# EAGLE design TurretController (EAGLE 9.6.2)

## Sheet 1 of 5: Microcontroller
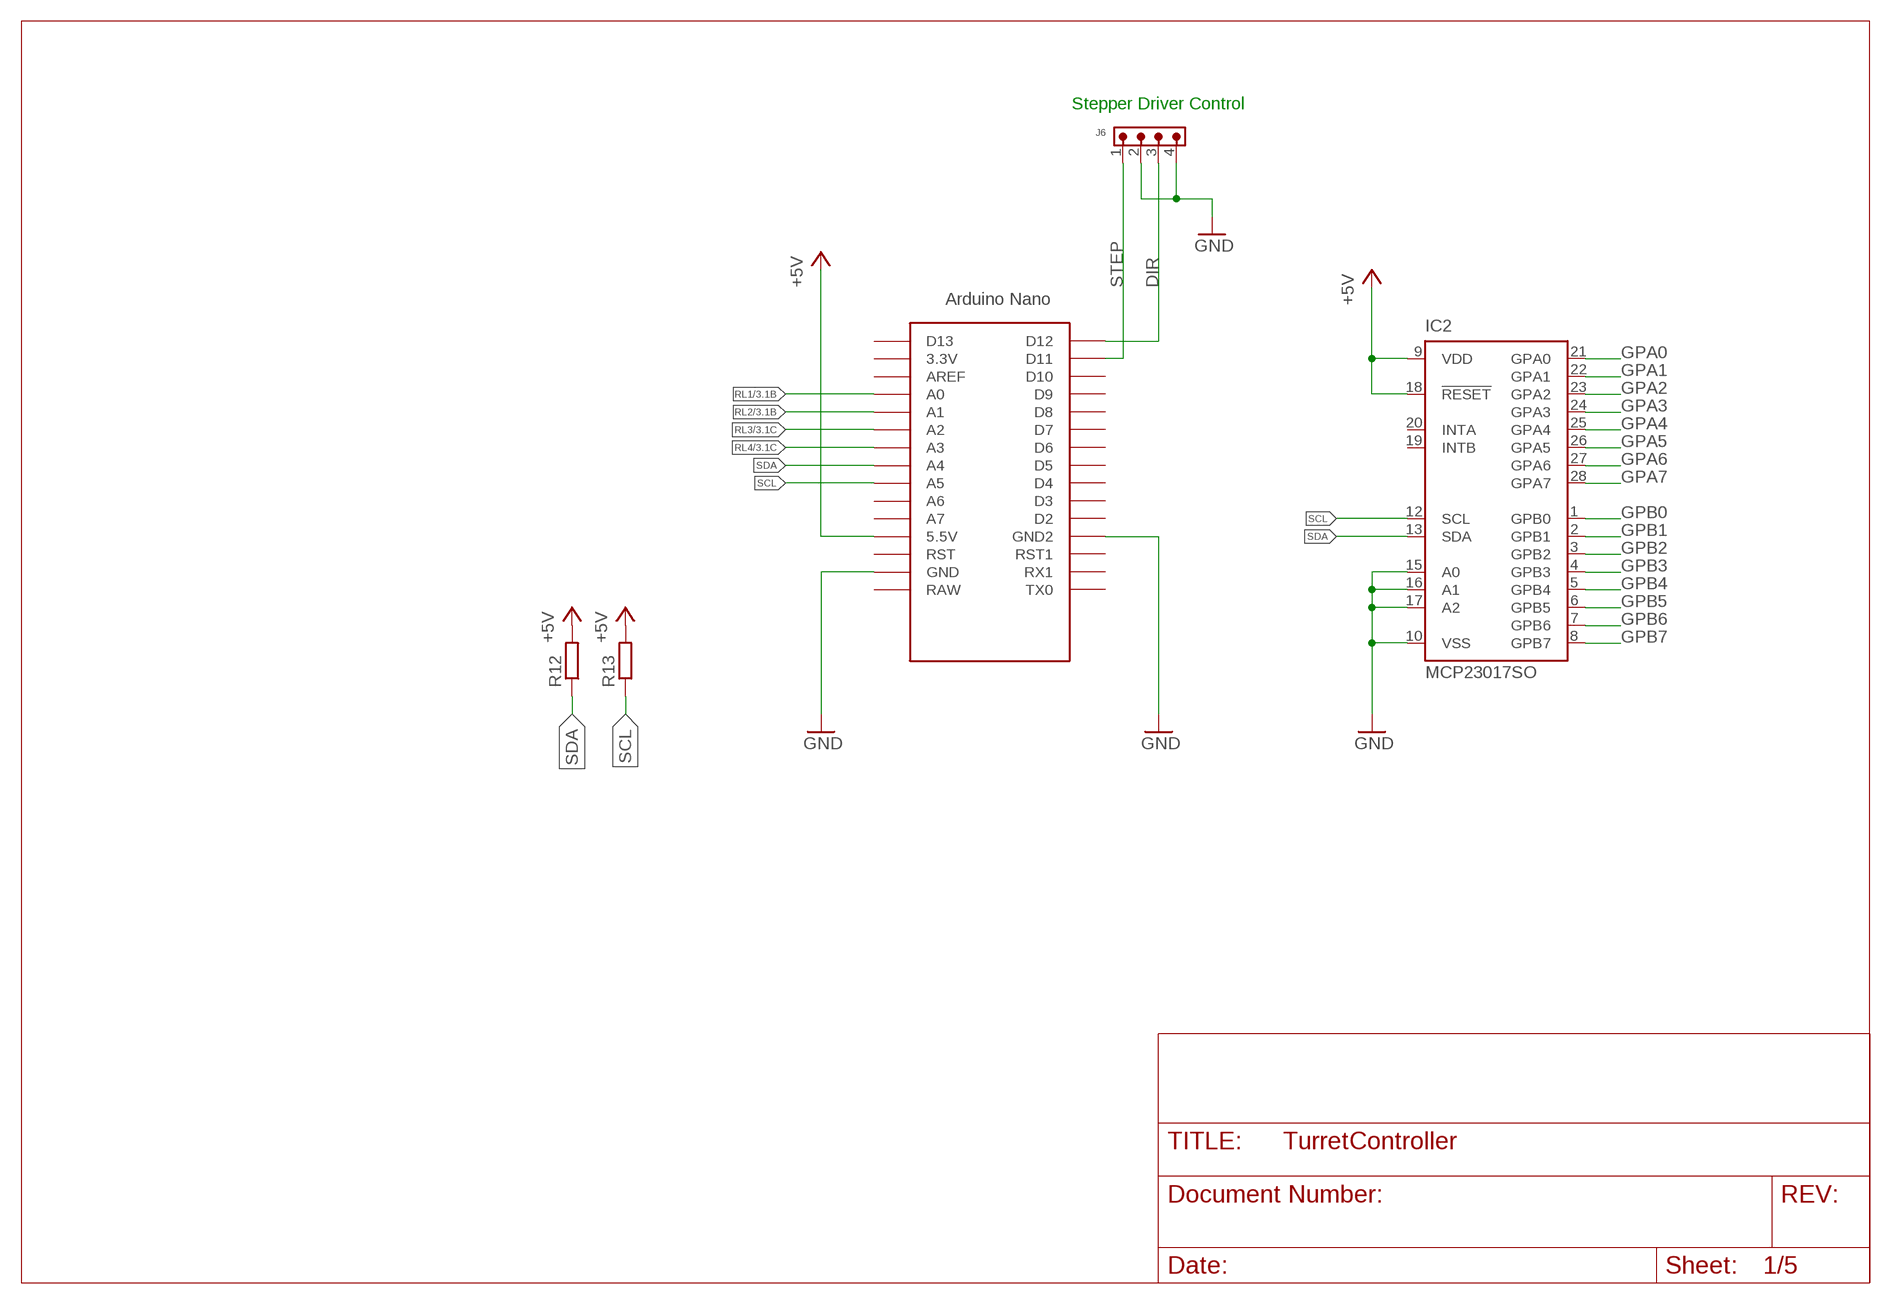
[diagram p0: schematic, sheet 1]

### Parts
IC2  MCP23017SO  [SO28W]
J6  691305330004  [691305330004]
R12  R-EU_R0805  [R0805]
R13  R-EU_R0805  [R0805]
U$1  NANO  [NANO]

### Nets
+5V: IC2.9(VDD) IC2.18(!RESET) R12.2 R13.2 U$1.5V(5.5V) ; also sheet 2,4,5
DIR: J6.3 U$1.D12
GND: IC2.10(VSS) IC2.15(A0) IC2.16(A1) IC2.17(A2) J6.2 J6.4 U$1.GND U$1.GND1(GND2) ; also sheet 2,3,4,5
GPA0: IC2.21(GPA0) ; also sheet 4
GPA1: IC2.22(GPA1) ; also sheet 4
GPA2: IC2.23(GPA2) ; also sheet 4
GPA3: IC2.24(GPA3) ; also sheet 4
GPA4: IC2.25(GPA4) ; also sheet 4
GPA5: IC2.26(GPA5) ; also sheet 4
GPA6: IC2.27(GPA6) ; also sheet 4
GPA7: IC2.28(GPA7) ; also sheet 4
GPB0: IC2.1(GPB0) ; also sheet 5
GPB1: IC2.2(GPB1) ; also sheet 5
GPB2: IC2.3(GPB2) ; also sheet 5
GPB3: IC2.4(GPB3) ; also sheet 5
GPB4: IC2.5(GPB4) ; also sheet 5
GPB5: IC2.6(GPB5) ; also sheet 5
GPB6: IC2.7(GPB6) ; also sheet 5
GPB7: IC2.8(GPB7) ; also sheet 5
RL1: U$1.A0 ; also sheet 3
RL2: U$1.A1 ; also sheet 3
RL3: U$1.A2 ; also sheet 3
RL4: U$1.A3 ; also sheet 3
SCL: IC2.12(SCL) R13.1 U$1.A5
SDA: IC2.13(SDA) R12.1 U$1.A4
STEP: J6.1 U$1.D11
Unconnected: IC2.19(INTB) IC2.20(INTA) U$1.3.3V U$1.A6 U$1.A7 U$1.AREF U$1.D2 U$1.D3 U$1.D4 U$1.D5 U$1.D6 U$1.D7 U$1.D8 U$1.D9 U$1.D10 U$1.D13 U$1.RAW U$1.RST U$1.RST1 U$1.RX1 U$1.TX0

### Notes on the sheet
- Stepper Driver Control

## Sheet 2 of 5: Power Supply
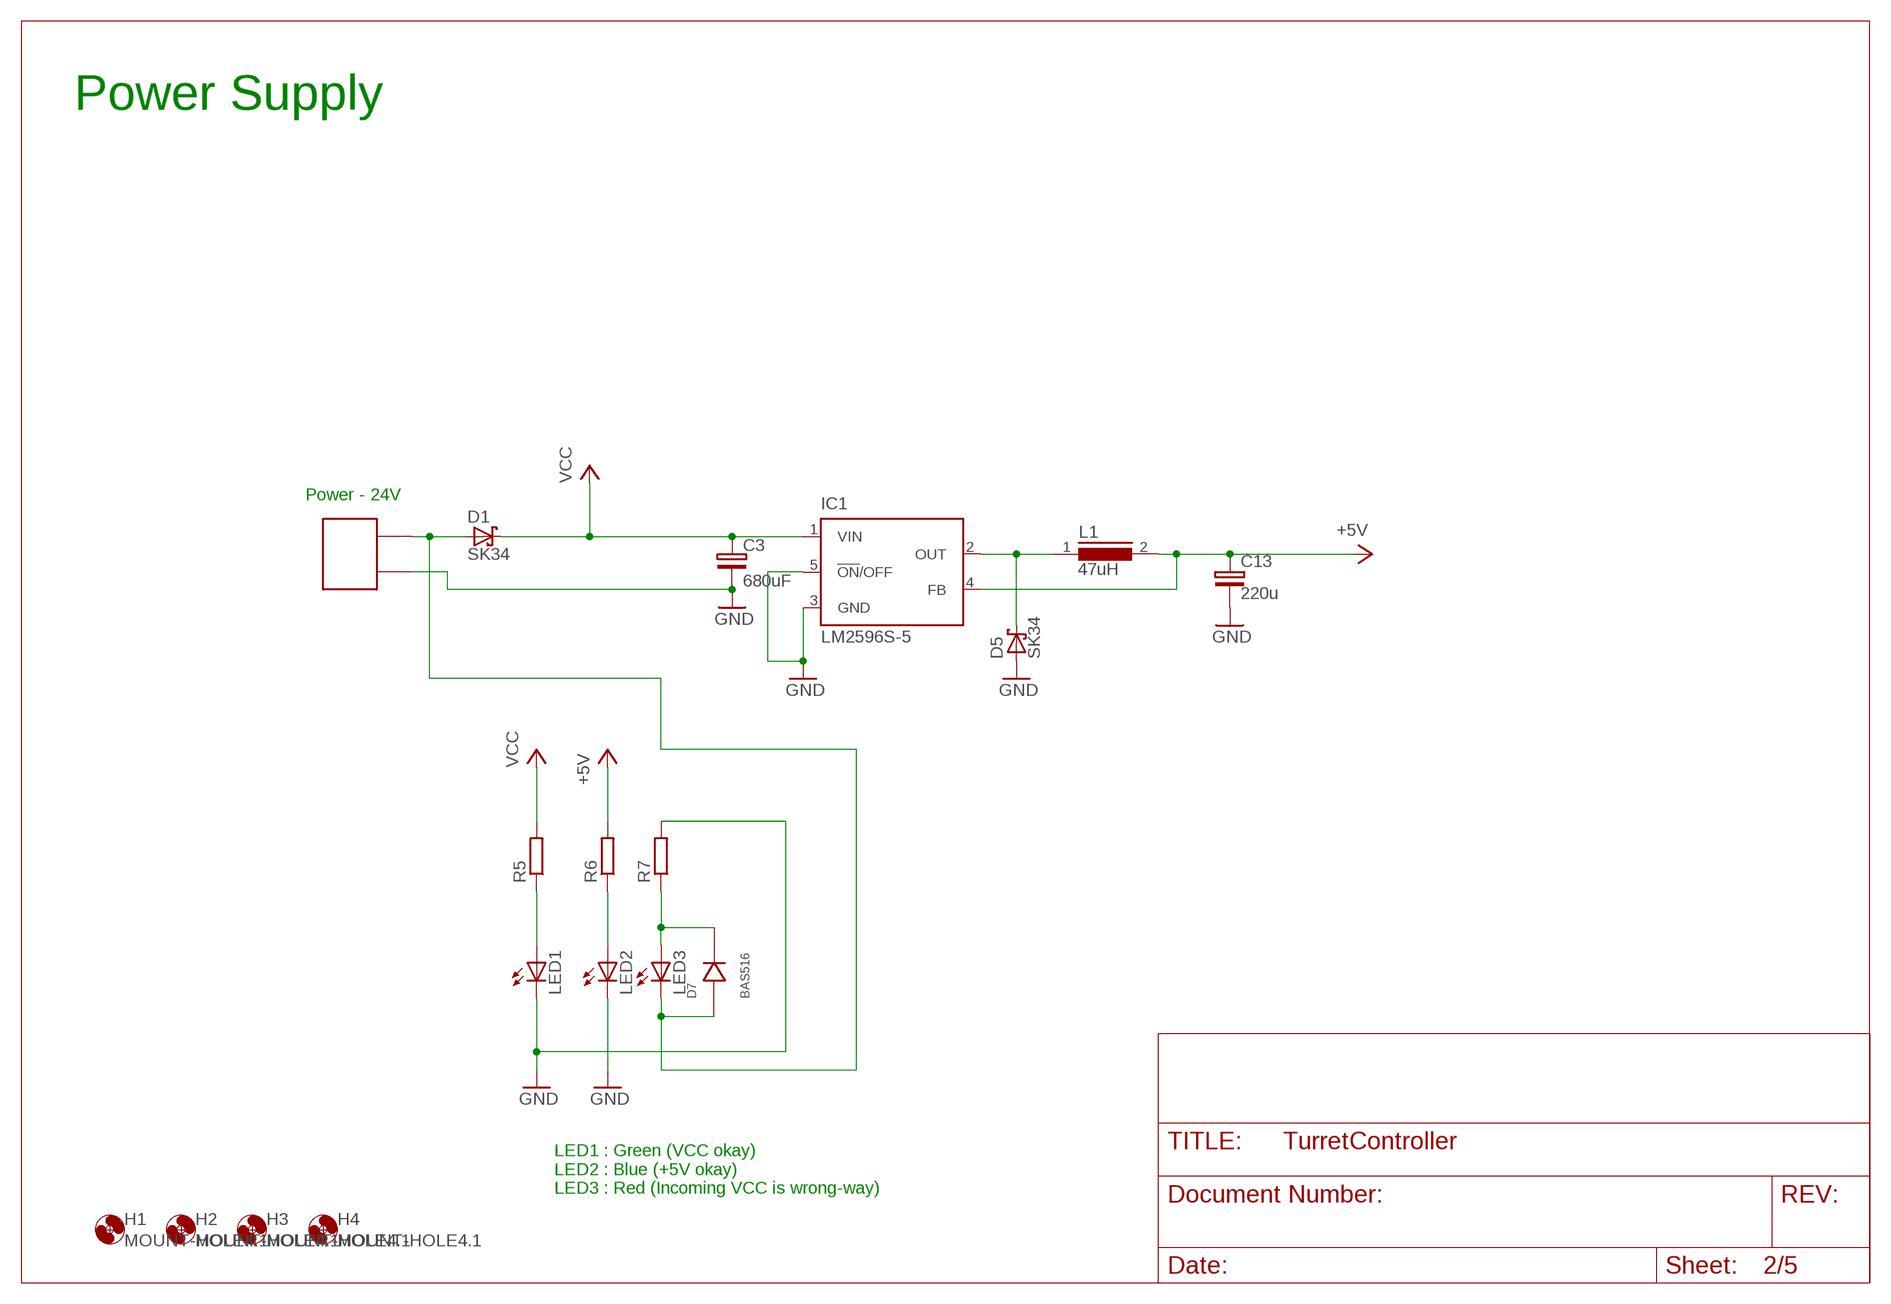
[diagram p1: schematic, sheet 2]

### Parts
C3  680uF  C-EU-ELECT680UF/25V  [C8.15X4X16.5]
C13  220u  PANASONIC-PTH220UF-25V  [PAN-PTH-8X11X3.5]
CN1  2EDG-2  [2EDG-2]
D1  SK34  [DO214AC]
D5  SK34  [DO214AC]
D7  BAS516  [SOD523]
H1  MOUNT-HOLE4.1  [4,1]
H2  MOUNT-HOLE4.1  [4,1]
H3  MOUNT-HOLE4.1  [4,1]
H4  MOUNT-HOLE4.1  [4,1]
IC1  LM2596S-5  LM2596S  [TO263-5]
L1  47uH  INDUCTOR-SMD  [B82476A1]
LED1  LEDCHIPLED_0805  [CHIPLED_0805]
LED2  LEDCHIPLED_0805  [CHIPLED_0805]
LED3  LEDCHIPLED_0805  [CHIPLED_0805]
R5  R-EU_R0805  [R0805]
R6  R-EU_R0805  [R0805]
R7  R-EU_R0805  [R0805]

### Nets
+5V: C13.+ IC1.4(FB) L1.2 R6.2 ; also sheet 1,4,5
GND: C3.- C13.- CN1.P$1 D5.A IC1.3(GND) IC1.5(!ON!/OFF) LED1.C LED2.C R7.2 ; also sheet 1,3,4,5
N$16: D7.C(K) LED3.A R7.1
N$19 [HighPwr]: D5.C IC1.2(OUT) L1.1
N$24: CN1.P$2 D1.A D7.A LED3.C
N$25: LED1.A R5.1
N$26: LED2.A R6.1
VCC: C3.+ D1.C IC1.1(VIN) R5.2 ; also sheet 3,4,5

### Notes on the sheet
- Power Supply
- Power - 24V
- LED1 : Green (VCC okay)
  LED2 : Blue (+5V okay)
  LED3 : Red (Incoming VCC is wrong-way)

## Sheet 3 of 5: Relay Board
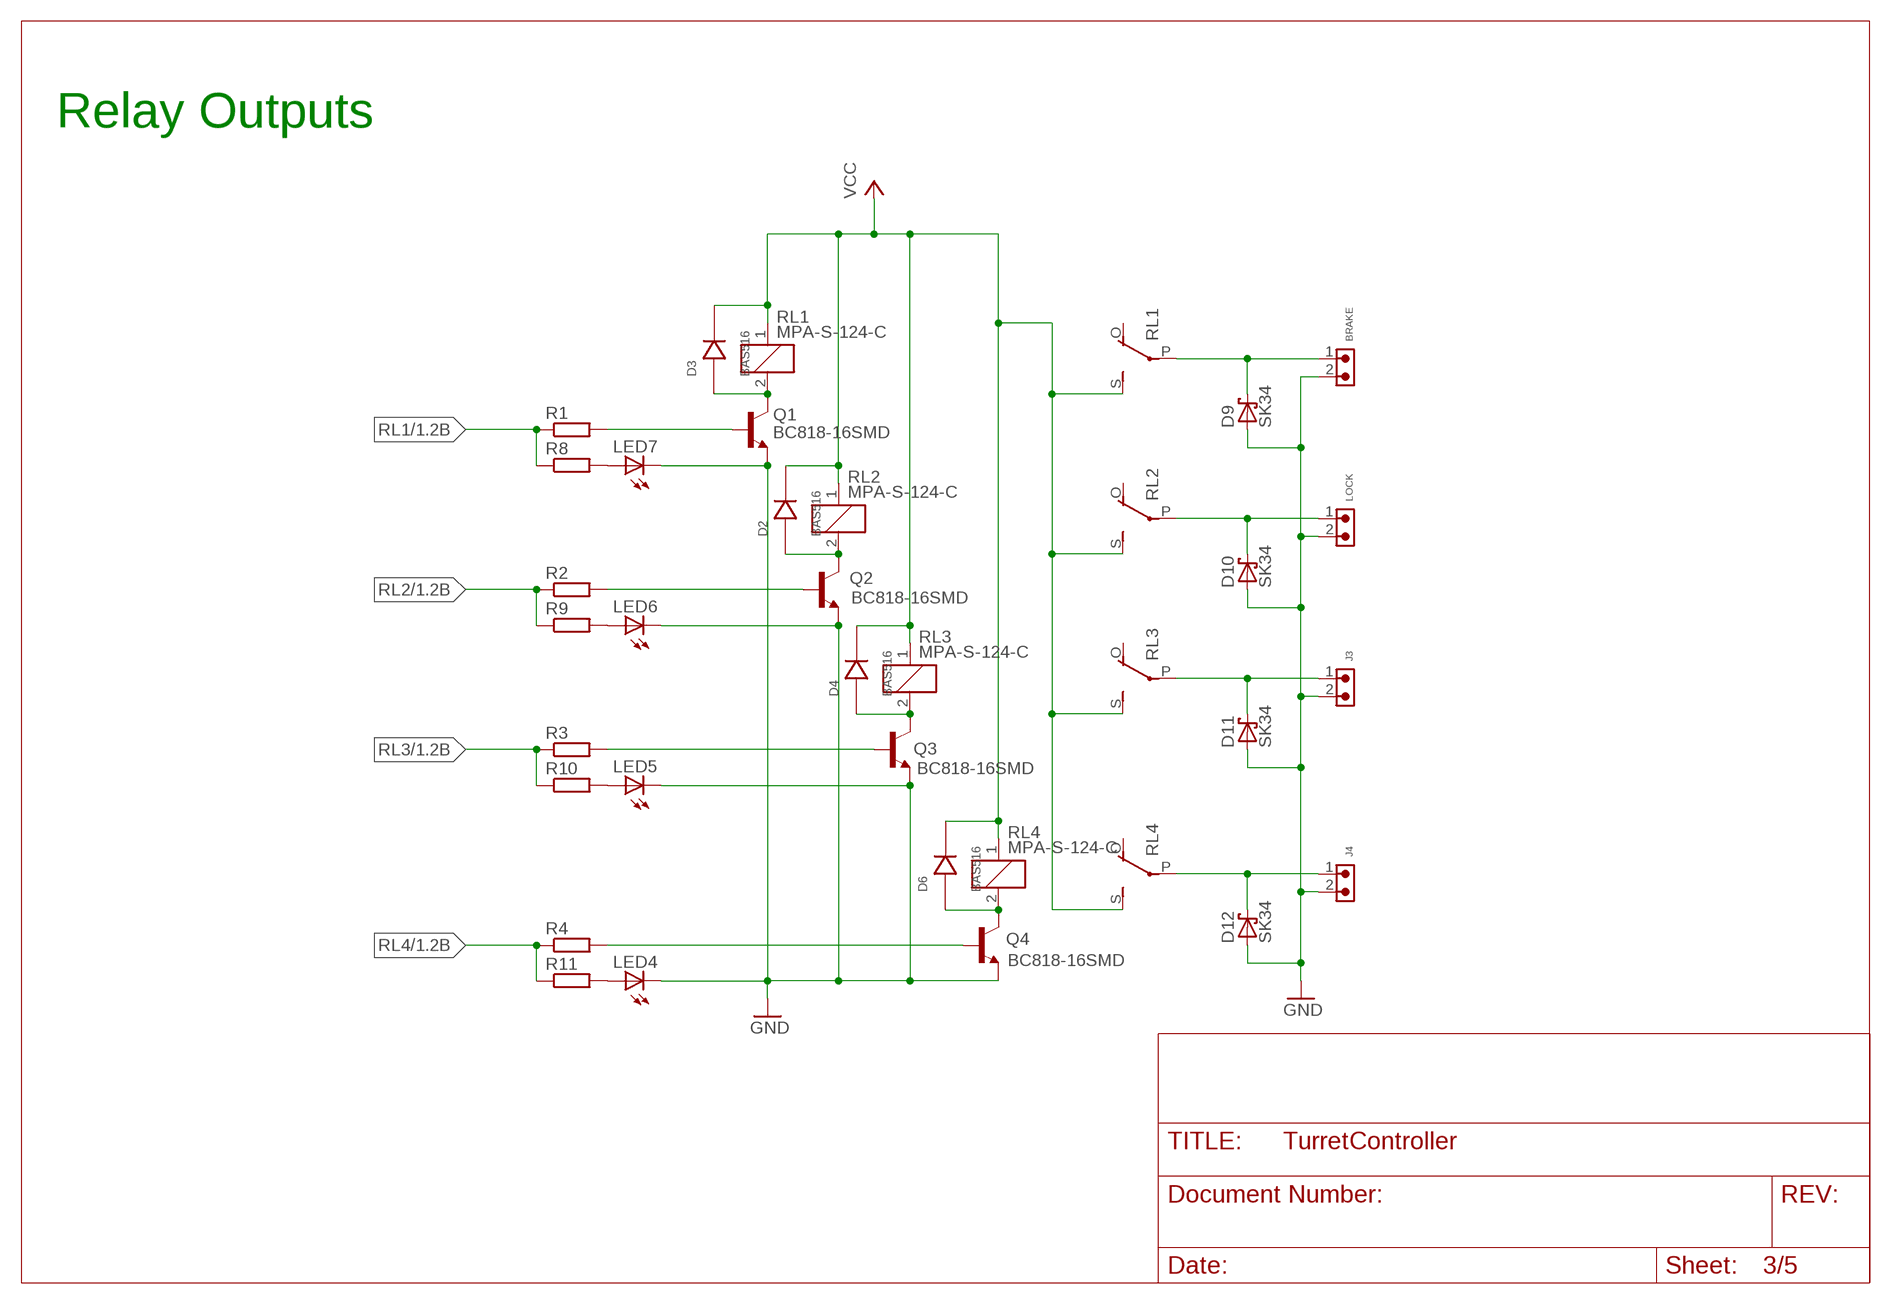
[diagram p2: schematic, sheet 3]

### Parts
BRAKE  691305330002  [691305330002]
D2  BAS516  [SOD523]
D3  BAS516  [SOD523]
D4  BAS516  [SOD523]
D6  BAS516  [SOD523]
D9  SK34  [DO214AC]
D10  SK34  [DO214AC]
D11  SK34  [DO214AC]
D12  SK34  [DO214AC]
J3  691305330002  [691305330002]
J4  691305330002  [691305330002]
LED4  LEDCHIPLED_0805  [CHIPLED_0805]
LED5  LEDCHIPLED_0805  [CHIPLED_0805]
LED6  LEDCHIPLED_0805  [CHIPLED_0805]
LED7  LEDCHIPLED_0805  [CHIPLED_0805]
LOCK  691305330002  [691305330002]
Q1  BC818-16SMD  [SOT23-BEC]
Q2  BC818-16SMD  [SOT23-BEC]
Q3  BC818-16SMD  [SOT23-BEC]
Q4  BC818-16SMD  [SOT23-BEC]
R1  R-EU_R0805  [R0805]
R2  R-EU_R0805  [R0805]
R3  R-EU_R0805  [R0805]
R4  R-EU_R0805  [R0805]
R8  R-EU_R0805  [R0805]
R9  R-EU_R0805  [R0805]
R10  R-EU_R0805  [R0805]
R11  R-EU_R0805  [R0805]
RL1  MPA-S-124-C  [G5LE]
RL2  MPA-S-124-C  [G5LE]
RL3  MPA-S-124-C  [G5LE]
RL4  MPA-S-124-C  [G5LE]

### Nets
GND: BRAKE.2 D9.A D10.A D11.A D12.A J3.2 J4.2 LED4.C LED5.C LED6.C LED7.C LOCK.2 Q1.E Q2.E Q3.E Q4.E ; also sheet 1,2,4,5
N$3: D12.C J4.1 RL4.P
N$4: D11.C J3.1 RL3.P
N$9: D10.C LOCK.1 RL2.P
N$11: BRAKE.1 D9.C RL1.P
N$13: D2.A Q2.C RL2.2
N$14: LED4.A R11.2
N$15: D4.A Q3.C RL3.2
N$17: D3.A Q1.C RL1.2
N$18: D6.A Q4.C RL4.2
N$20: Q1.B R1.2
N$21: Q2.B R2.2
N$22: Q3.B R3.2
N$23: Q4.B R4.2
N$27: LED5.A R10.2
N$28: LED6.A R9.2
N$29: LED7.A R8.2
RL1: R1.1 R8.1 ; also sheet 1
RL2: R2.1 R9.1 ; also sheet 1
RL3: R3.1 R10.1 ; also sheet 1
RL4: R4.1 R11.1 ; also sheet 1
VCC: D2.C(K) D3.C(K) D4.C(K) D6.C(K) RL1.1 RL1.S RL2.1 RL2.S RL3.1 RL3.S RL4.1 RL4.S ; also sheet 2,4,5
Unconnected: RL1.O RL2.O RL3.O RL4.O

### Notes on the sheet
- Relay Outputs

## Sheet 4 of 5: General I/O
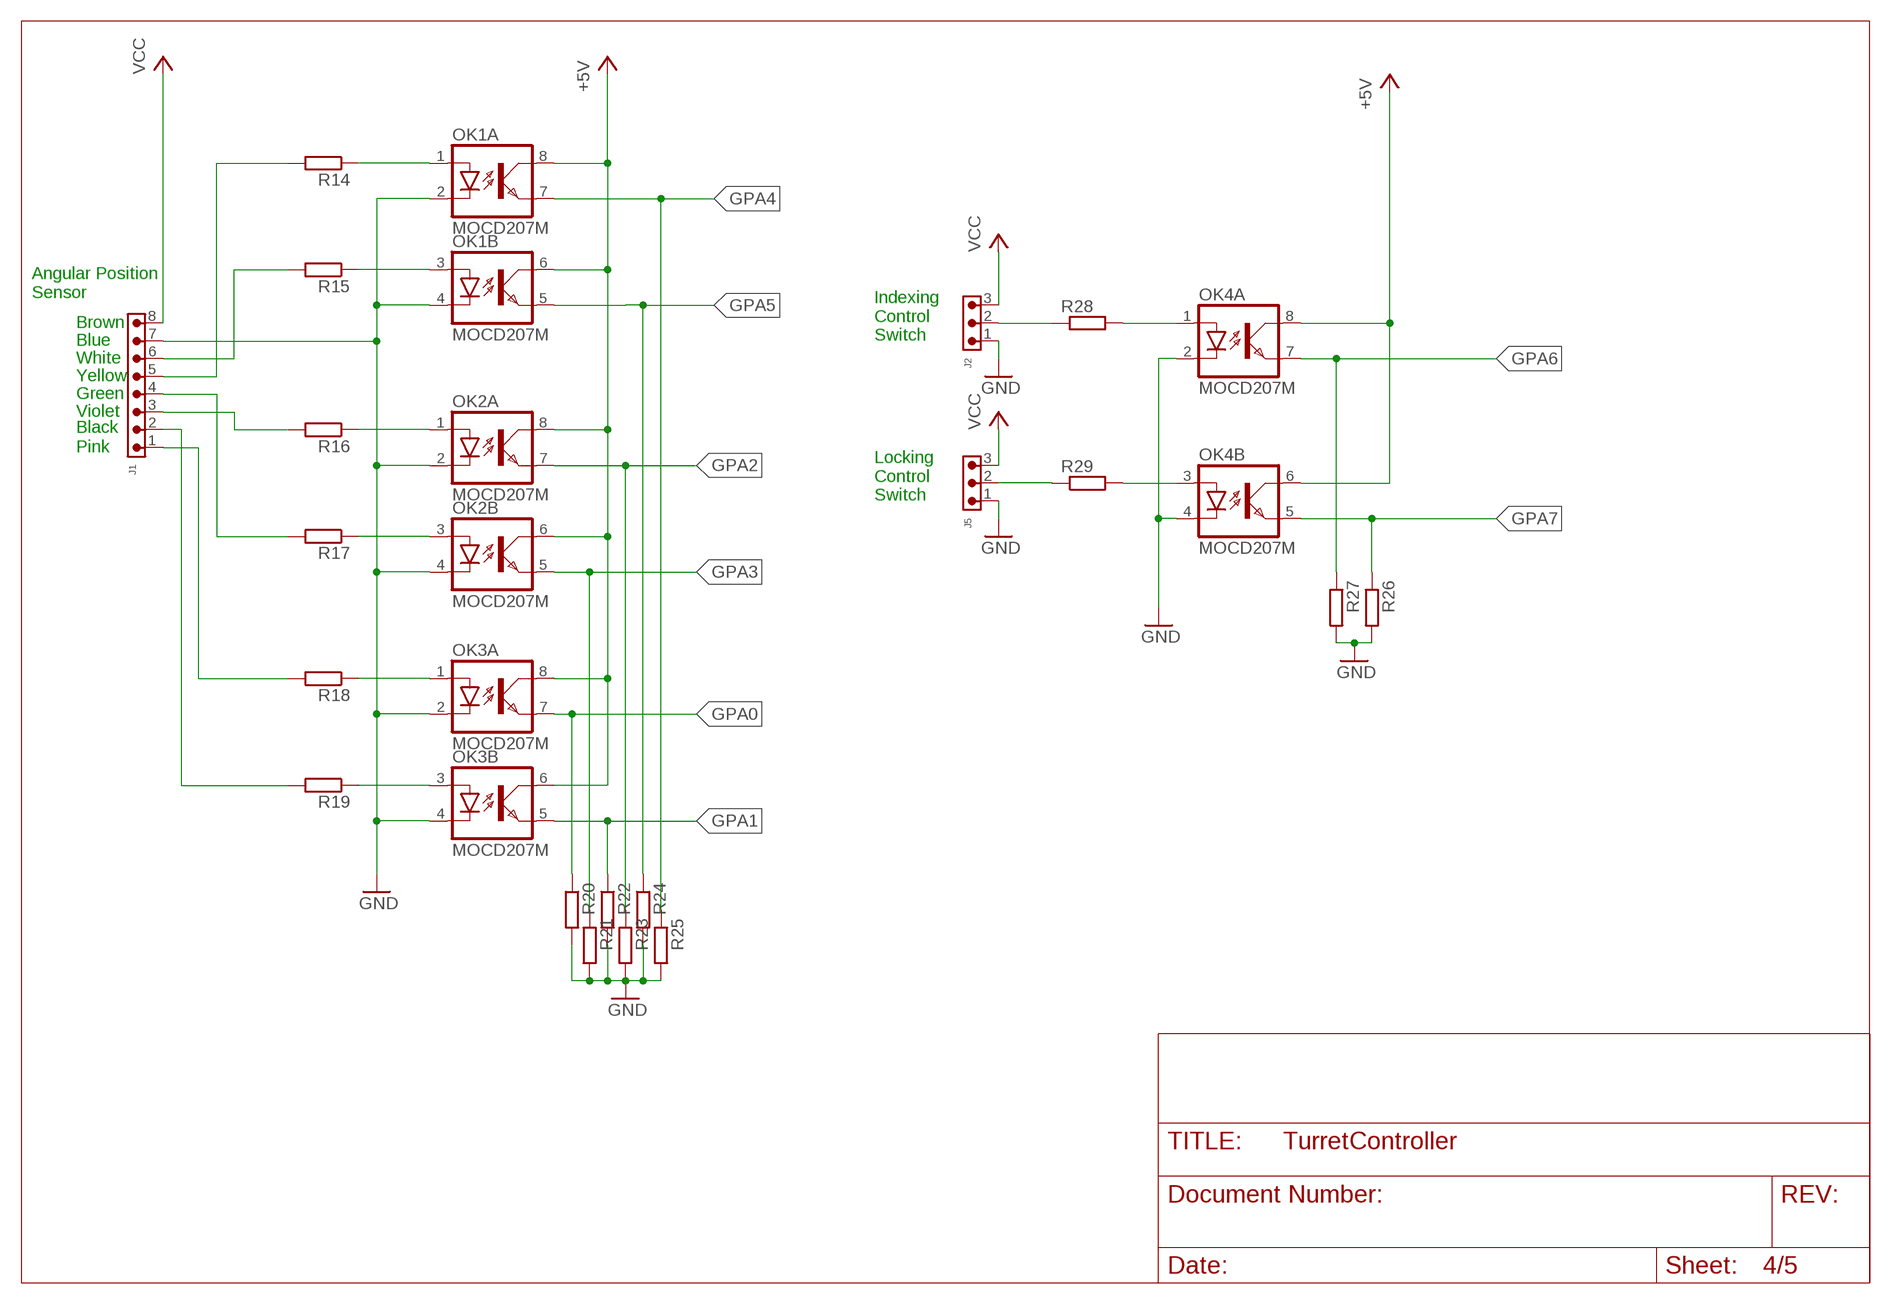
[diagram p3: schematic, sheet 4]

### Parts
J1  691305330008  [691305330008]
J2  691305330003  [691305330003]
J5  691305330003  [691305330003]
OK1  MOCD207M  [SOIC08-FAIRCHILD]
OK2  MOCD207M  [SOIC08-FAIRCHILD]
OK3  MOCD207M  [SOIC08-FAIRCHILD]
OK4  MOCD207M  [SOIC08-FAIRCHILD]
R14  R-EU_R0805  [R0805]
R15  R-EU_R0805  [R0805]
R16  R-EU_R0805  [R0805]
R17  R-EU_R0805  [R0805]
R18  R-EU_R0805  [R0805]
R19  R-EU_R0805  [R0805]
R20  R-EU_R0805  [R0805]
R21  R-EU_R0805  [R0805]
R22  R-EU_R0805  [R0805]
R23  R-EU_R0805  [R0805]
R24  R-EU_R0805  [R0805]
R25  R-EU_R0805  [R0805]
R26  R-EU_R0805  [R0805]
R27  R-EU_R0805  [R0805]
R28  R-EU_R0805  [R0805]
R29  R-EU_R0805  [R0805]

### Nets
+5V: OK1.6(B:COL) OK1.8(A:COL) OK2.6(B:COL) OK2.8(A:COL) OK3.6(B:COL) OK3.8(A:COL) OK4.6(B:COL) OK4.8(A:COL) ; also sheet 1,2,5
GND: J1.7 J2.1 J5.1 OK1.2(A:C) OK1.4(B:C) OK2.2(A:C) OK2.4(B:C) OK3.2(A:C) OK3.4(B:C) OK4.2(A:C) OK4.4(B:C) R20.2 R21.2 R22.2 R23.2 R24.2 R25.2 R26.2 R27.2 ; also sheet 1,2,3,5
GPA0: OK3.7(A:EMIT) R20.1 ; also sheet 1
GPA1: OK3.5(B:EMIT) R22.1 ; also sheet 1
GPA2: OK2.7(A:EMIT) R23.1 ; also sheet 1
GPA3: OK2.5(B:EMIT) R21.1 ; also sheet 1
GPA4: OK1.7(A:EMIT) R25.1 ; also sheet 1
GPA5: OK1.5(B:EMIT) R24.1 ; also sheet 1
GPA6: OK4.7(A:EMIT) R27.1 ; also sheet 1
GPA7: OK4.5(B:EMIT) R26.1 ; also sheet 1
N$1: J1.1 R18.2
N$2: J2.2 R28.1
N$5: OK4.1(A:A) R28.2
N$6: OK4.3(B:A) R29.2
N$7: J5.2 R29.1
N$12: J1.3 R16.2
N$30: J1.4 R17.2
N$31: J1.6 R15.2
N$34: J1.5 R14.2
N$35: OK2.3(B:A) R17.1
N$36: OK1.1(A:A) R14.1
N$37: OK1.3(B:A) R15.1
N$38: OK2.1(A:A) R16.1
N$40: OK3.1(A:A) R18.1
N$41: OK3.3(B:A) R19.1
N$42: J1.2 R19.2
VCC: J1.8 J2.3 J5.3 ; also sheet 2,3,5

### Notes on the sheet
- Angular Position
  Sensor
- Brown
- Indexing
  Control
  Switch
- Blue
- White
- Yellow
- Green
- Violet
- Black
- Pink
- Locking
  Control
  Switch

## Sheet 5 of 5: LinuxCNC IO
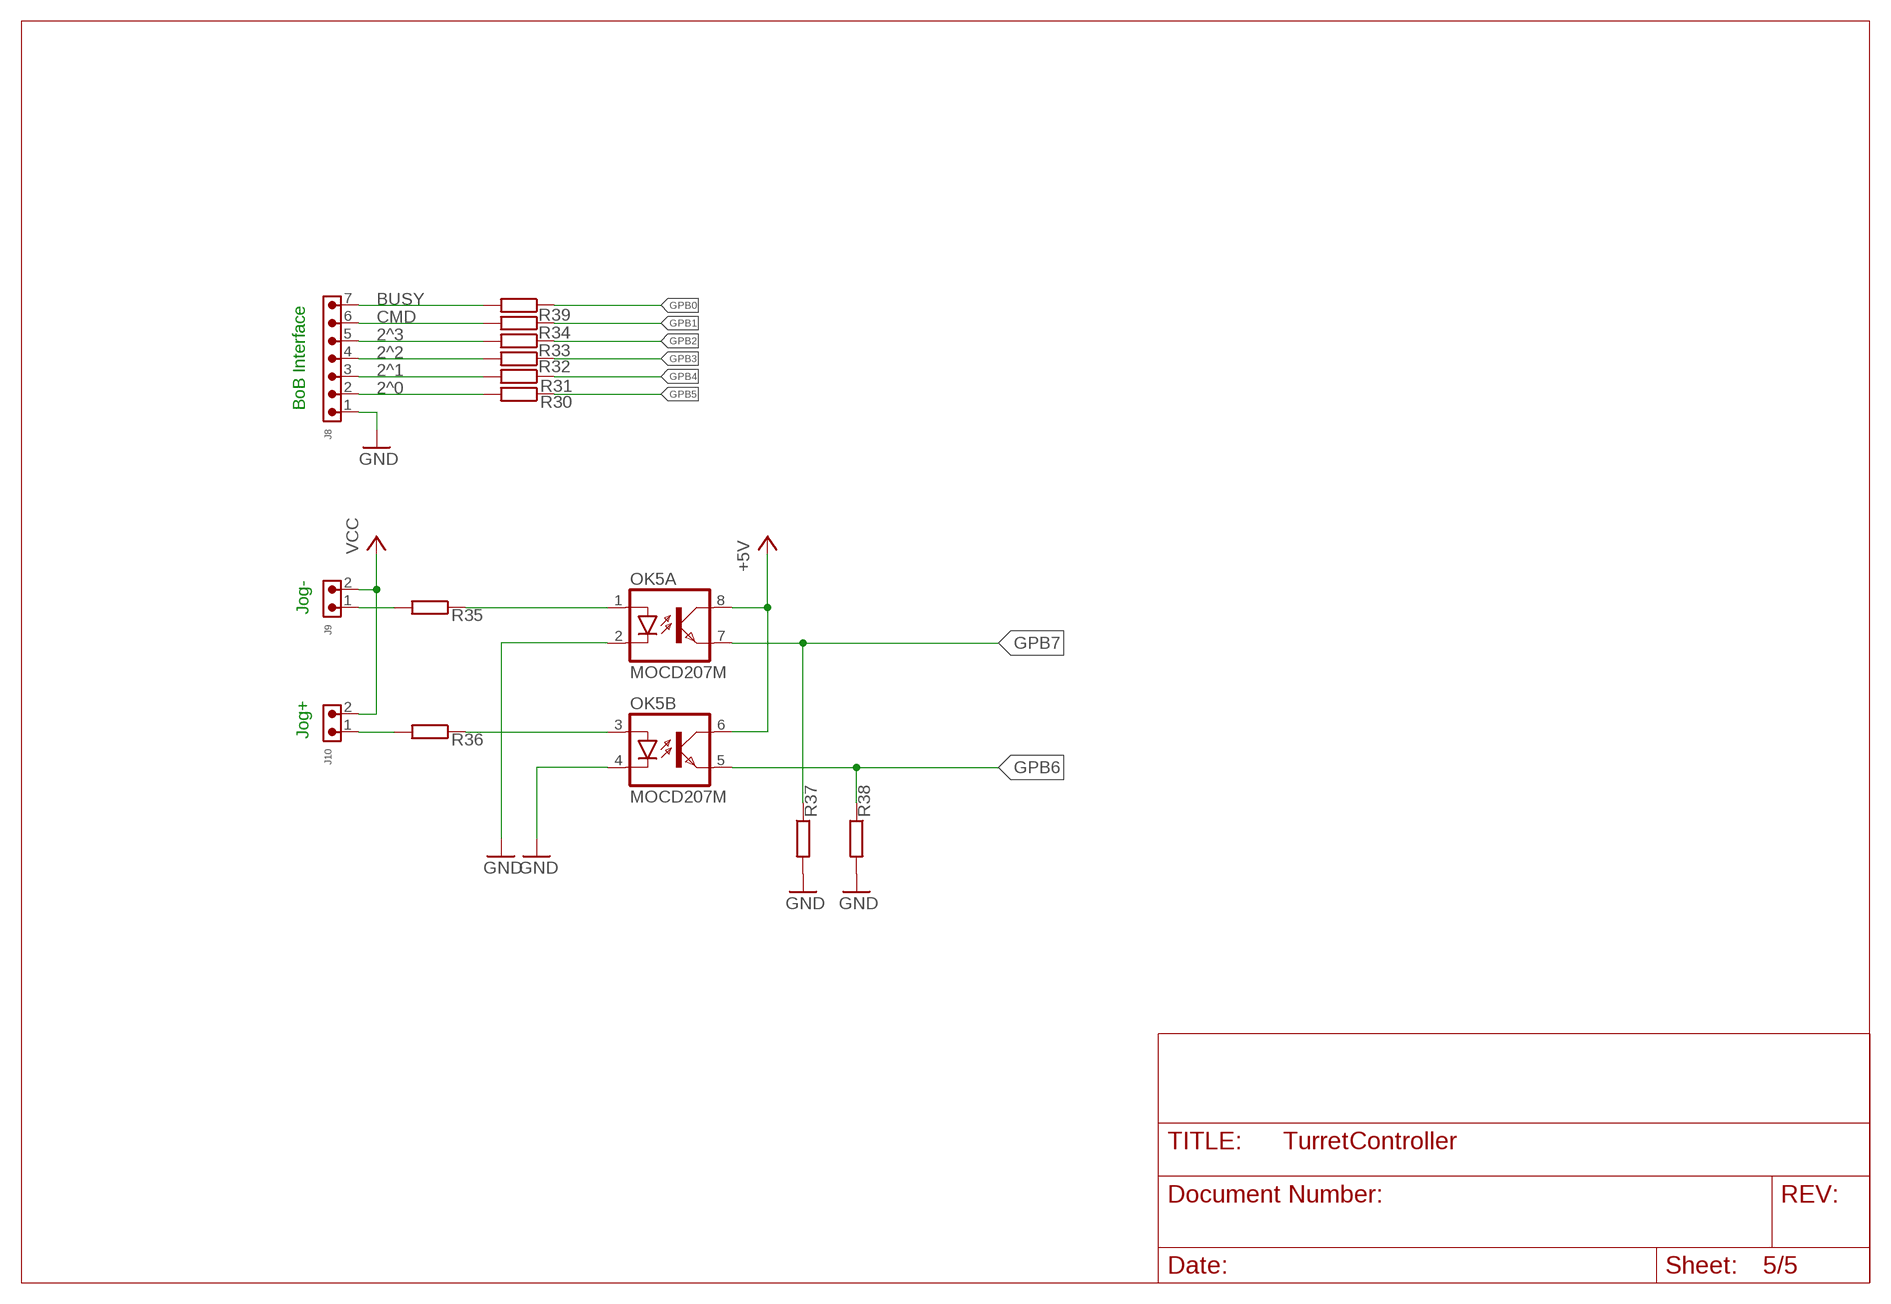
[diagram p4: schematic, sheet 5]

### Parts
J8  691305330007  [691305330007]
J9  691305330002  [691305330002]
J10  691305330002  [691305330002]
OK5  MOCD207M  [SOIC08-FAIRCHILD]
R30  R-EU_R0805  [R0805]
R31  R-EU_R0805  [R0805]
R32  R-EU_R0805  [R0805]
R33  R-EU_R0805  [R0805]
R34  R-EU_R0805  [R0805]
R35  R-EU_R0805  [R0805]
R36  R-EU_R0805  [R0805]
R37  R-EU_R0805  [R0805]
R38  R-EU_R0805  [R0805]
R39  R-EU_R0805  [R0805]

### Nets
2^0: J8.2 R30.2
2^1: J8.3 R31.2
2^2: J8.4 R32.2
2^3: J8.5 R33.2
+5V: OK5.6(B:COL) OK5.8(A:COL) ; also sheet 1,2,4
BUSY: J8.7 R39.2
CMD: J8.6 R34.2
GND: J8.1 OK5.2(A:C) OK5.4(B:C) R37.2 R38.2 ; also sheet 1,2,3,4
GPB0: R39.1 ; also sheet 1
GPB1: R34.1 ; also sheet 1
GPB2: R33.1 ; also sheet 1
GPB3: R32.1 ; also sheet 1
GPB4: R31.1 ; also sheet 1
GPB5: R30.1 ; also sheet 1
GPB6: OK5.5(B:EMIT) R38.1 ; also sheet 1
GPB7: OK5.7(A:EMIT) R37.1 ; also sheet 1
N$45: J9.1 R35.2
N$46: J10.1 R36.2
N$49: OK5.3(B:A) R36.1
N$50: OK5.1(A:A) R35.1
VCC: J9.2 J10.2 ; also sheet 2,3,4

### Notes on the sheet
- BoB Interface
- Jog-
- Jog+

## Library data of the parts
BRAKE J3 J4 J9 J10 LOCK = Con-BoardToWire-Vertical:691305330002: WR-TBL Serie 3053 - 3.81 mm Vertical PCB Header KIND PROPERTIES Pitch 3.81 mm MATERIAL PROPERTIES Insulator Material PA66 Insulator Flammability Rating UL94 V-0 Insulator Color Green Contact Material Copper Alloy Contact Plating Tin GENERAL INFORMATION Operating Temperature -40 up to +105 °C Compliance Lead free / RoHS ELECTRICAL PROPERTIES IR UL 12 A Working Voltage [UL] 300 V (AC) Withstanding Voltage [UL] 2500 V (AC) Contact Resistance 20 mΩ CERTIFICATION UL Approval E315414 <https://www.we-online.com/catalog/media/o84288v209%20Family_WR-TBL_6913053300xx.jpg> Details see: https://www.we-online.com/catalog/en/TBL_3_81_3053_VERTICAL_PCB_HEADER_6913053300xx/ Updated by Ella Wu 2019-12-23 2019(C) Wurth Elektronik; DATASHEET-URL: https://www.we-online.com/catalog/datasheet/691305330002.pdf; IR-UL: 12A; MOUNT: THT; PART-NUMBER: 691305330002; PINS: 2; PITCH: 3.81mm; TYPE: Vertical; WORKING-VOLTAGE-UL: 300V (AC)
C3 = Discretes:C-EU-ELECT; SPICEPREFIX: C
C13 = Capacitors:PANASONIC-PTH; SPICEPREFIX: C
CN1 = Removable Wire To Board:2EDG-2
D1 D5 D9-D12 = Diodes:SK34; SPICEPREFIX: D
D2-D4 D6 D7 = Diodes:BAS516
H1-H4 = holes:MOUNT-HOLE: MOUNTING HOLE with drill center marker
IC1 = Regulators:LM2596: SIMPLE SWITCHER® Power Converter 150 kHz 3A Step-Down Voltage Regulator Source: http://www.national.com/ds/LM/LM2596.pdf; MF: NATIONAL SEMICONDUCTOR; MPN: LM2596S-ADJ/NOPB; OC_FARNELL: 9494367; OC_NEWARK: 41K3842; SPICEPREFIX: X
IC2 = microchip:MCP23017: http://ww1.microchip.com/downloads/en/DeviceDoc/21952a.pdf Source: http://ww1.microchip.com/downloads/en/DeviceDoc/21952a.pdf; MF: MICROCHIP; MPN: MCP23017-E/SO; OC_FARNELL: 1332087; OC_NEWARK: 31K2958
J1 = Con-BoardToWire-Vertical:691305330008: WR-TBL Serie 3053 - 3.81 mm Vertical PCB Header KIND PROPERTIES Pitch 3.81 mm MATERIAL PROPERTIES Insulator Material PA66 Insulator Flammability Rating UL94 V-0 Insulator Color Green Contact Material Copper Alloy Contact Plating Tin GENERAL INFORMATION Operating Temperature -40 up to +105 °C Compliance Lead free / RoHS ELECTRICAL PROPERTIES IR UL 12 A Working Voltage [UL] 300 V (AC) Withstanding Voltage [UL] 2500 V (AC) Contact Resistance 20 mΩ CERTIFICATION UL Approval E315414 <https://www.we-online.com/catalog/media/o84288v209%20Family_WR-TBL_6913053300xx.jpg> Details see: https://www.we-online.com/catalog/en/TBL_3_81_3053_VERTICAL_PCB_HEADER_6913053300xx/ Updated by Ella Wu 2019-12-23 2019(C) Wurth Elektronik; DATASHEET-URL: https://www.we-online.com/catalog/datasheet/691305330008.pdf; IR-UL: 12A; MOUNT: THT; PART-NUMBER: 691305330008; PINS: 8; PITCH: 3.81mm; TYPE: Vertical; WORKING-VOLTAGE-UL: 300V (AC)
J2 J5 = Con-BoardToWire-Vertical:691305330003: WR-TBL Serie 3053 - 3.81 mm Vertical PCB Header KIND PROPERTIES Pitch 3.81 mm MATERIAL PROPERTIES Insulator Material PA66 Insulator Flammability Rating UL94 V-0 Insulator Color Green Contact Material Copper Alloy Contact Plating Tin GENERAL INFORMATION Operating Temperature -40 up to +105 °C Compliance Lead free / RoHS ELECTRICAL PROPERTIES IR UL 12 A Working Voltage [UL] 300 V (AC) Withstanding Voltage [UL] 2500 V (AC) Contact Resistance 20 mΩ CERTIFICATION UL Approval E315414 <https://www.we-online.com/catalog/media/o84288v209%20Family_WR-TBL_6913053300xx.jpg> Details see: https://www.we-online.com/catalog/en/TBL_3_81_3053_VERTICAL_PCB_HEADER_6913053300xx/ Updated by Ella Wu 2019-12-23 2019(C) Wurth Elektronik; DATASHEET-URL: https://www.we-online.com/catalog/datasheet/691305330003.pdf; IR-UL: 12A; MOUNT: THT; PART-NUMBER: 691305330003; PINS: 3; PITCH: 3.81mm; TYPE: Vertical; WORKING-VOLTAGE-UL: 300V (AC)
J6 = Con-BoardToWire-Vertical:691305330004: WR-TBL Serie 3053 - 3.81 mm Vertical PCB Header KIND PROPERTIES Pitch 3.81 mm MATERIAL PROPERTIES Insulator Material PA66 Insulator Flammability Rating UL94 V-0 Insulator Color Green Contact Material Copper Alloy Contact Plating Tin GENERAL INFORMATION Operating Temperature -40 up to +105 °C Compliance Lead free / RoHS ELECTRICAL PROPERTIES IR UL 12 A Working Voltage [UL] 300 V (AC) Withstanding Voltage [UL] 2500 V (AC) Contact Resistance 20 mΩ CERTIFICATION UL Approval E315414 <https://www.we-online.com/catalog/media/o84288v209%20Family_WR-TBL_6913053300xx.jpg> Details see: https://www.we-online.com/catalog/en/TBL_3_81_3053_VERTICAL_PCB_HEADER_6913053300xx/ Updated by Ella Wu 2019-12-23 2019(C) Wurth Elektronik; DATASHEET-URL: https://www.we-online.com/catalog/datasheet/691305330004.pdf; IR-UL: 12A; MOUNT: THT; PART-NUMBER: 691305330004; PINS: 4; PITCH: 3.81mm; TYPE: Vertical; WORKING-VOLTAGE-UL: 300V (AC)
J8 = Con-BoardToWire-Vertical:691305330007: WR-TBL Serie 3053 - 3.81 mm Vertical PCB Header KIND PROPERTIES Pitch 3.81 mm MATERIAL PROPERTIES Insulator Material PA66 Insulator Flammability Rating UL94 V-0 Insulator Color Green Contact Material Copper Alloy Contact Plating Tin GENERAL INFORMATION Operating Temperature -40 up to +105 °C Compliance Lead free / RoHS ELECTRICAL PROPERTIES IR UL 12 A Working Voltage [UL] 300 V (AC) Withstanding Voltage [UL] 2500 V (AC) Contact Resistance 20 mΩ CERTIFICATION UL Approval E315414 <https://www.we-online.com/catalog/media/o84288v209%20Family_WR-TBL_6913053300xx.jpg> Details see: https://www.we-online.com/catalog/en/TBL_3_81_3053_VERTICAL_PCB_HEADER_6913053300xx/ Updated by Ella Wu 2019-12-23 2019(C) Wurth Elektronik; DATASHEET-URL: https://www.we-online.com/catalog/datasheet/691305330007.pdf; IR-UL: 12A; MOUNT: THT; PART-NUMBER: 691305330007; PINS: 7; PITCH: 3.81mm; TYPE: Vertical; WORKING-VOLTAGE-UL: 300V (AC)
L1 = Discretes:INDUCTOR-SMD; SPICEPREFIX: L
LED1-LED7 = LEDs:LED: LED OSRAM: - CHIPLED LG R971, LG N971, LY N971, LG Q971, LY Q971, LO R971, LY R971 LH N974, LH R974 LS Q976, LO Q976, LY Q976 LO Q996 - Hyper CHIPLED LW Q18S LB Q993, LB Q99A, LB R99A - SideLED LS A670, LO A670, LY A670, LG A670, LP A670 LB A673, LV A673, LT A673, LW A673 LH A674 LY A675 LS A676, LA A676, LO A676, LY A676, LW A676 LS A679, LY A679, LG A679 - Hyper Micro SIDELED® LS Y876, LA Y876, LO Y876, LY Y876 LT Y87S - SmartLED LW L88C, LW L88S LB L89C, LB L89S, LG L890 LS L89K, LO L89K, LY L89K LS L896, LA L896, LO L896, LY L896 - TOPLED LS T670, LO T670, LY T670, LG T670, LP T670 LSG T670, LSP T670, LSY T670, LOP T670, LYG T670 LG T671, LOG T671, LSG T671 LB T673, LV T673, LT T673, LW T673 LH T674 LS T676, LA T676, LO T676, LY T676, LB T676, LH T676, LSB T676, LW T676 LB T67C, LV T67C, LT T67C, LS T67K, LO T67K, LY T67K, LW E67C LS E67B, LA E67B, LO E67B, LY E67B, LB E67C, LV E67C, LT E67C LW T67C LS T679, LY T679, LG T679 LS T770, LO T770, LY T770, LG T770, LP T770 LB T773, LV T773, LT T773, LW T773 LH T774 LS E675, LA E675, LY E675, LS T675 LS T776, LA T776, LO T776, LY T776, LB T776 LHGB T686 LT T68C, LB T68C - Hyper Mini TOPLED® LB M676 - Mini TOPLED Santana® LG M470 LS M47K, LO M47K, LY M47K Source: http://www.osram.convergy.de LUXEON: - LUMILED® LXK2-PW12-R00, LXK2-PW12-S00, LXK2-PW14-U00, LXK2-PW14-V00 LXK2-PM12-R00, LXK2-PM12-S00, LXK2-PM14-U00 LXK2-PE12-Q00, LXK2-PE12-R00, LXK2-PE12-S00, LXK2-PE14-T00, LXK2-PE14-U00 LXK2-PB12-K00, LXK2-PB12-L00, LXK2-PB12-M00, LXK2-PB14-N00, LXK2-PB14-P00, LXK2-PB14-Q00 LXK2-PR12-L00, LXK2-PR12-M00, LXK2-PR14-Q00, LXK2-PR14-R00 LXK2-PD12-Q00, LXK2-PD12-R00, LXK2-PD12-S00 LXK2-PH12-R00, LXK2-PH12-S00 LXK2-PL12-P00, LXK2-PL12-Q00, LXK2-PL12-R00 Source: www.luxeon.com KINGBRIGHT: KA-3528ASYC Source: www.kingbright.com
OK1-OK5 = optocoupler:MOCD20*M: MOCD207M, MOCD208M Dual Channel Phototransistor Small Outline Surface Mount Optocouplers Source: Data sheet <http://www.fairchildsemi.com/ds/MO%2FMOCD207-M.pdf>; MF: FAIRCHILD SEMICONDUCTOR; MPN: MOCD207-M; OC_FARNELL: 1623297; OC_NEWARK: 67K0803
Q1-Q4 = transistor-npn:BC818*: NPN Transistor
R1-R39 = rcl:R-EU_: RESISTOR, European symbol; SPICEPREFIX: R
RL1-RL4 = Relays:MPA-S-124-C
U$1 = Arduino-clone:NANO: Arduino Nano

## Net classes
1 HighPwr: width 0.305 mm
2 gnd: width 0.305 mm, drill 0.406 mm, clearance 0.203 mm
3 power usb: width 0.508 mm, drill 0.406 mm, clearance 0.203 mm

## Board
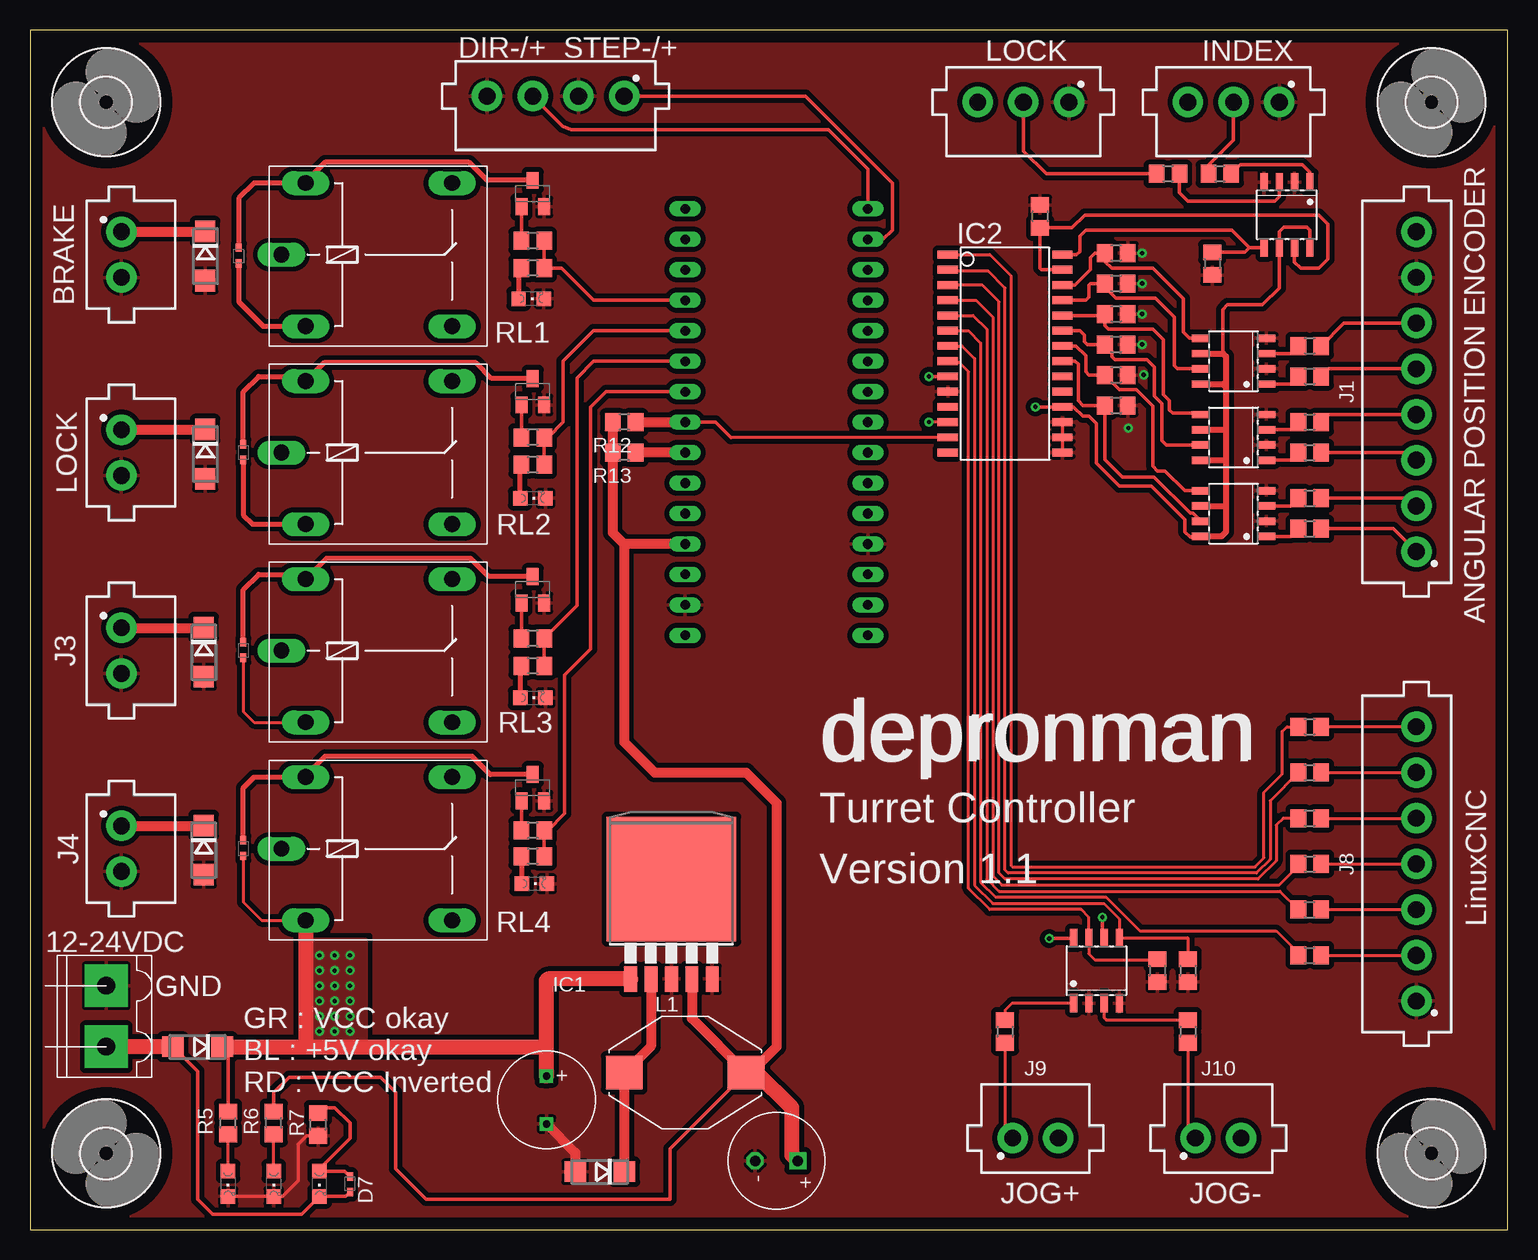
[diagram p5: board, top side]
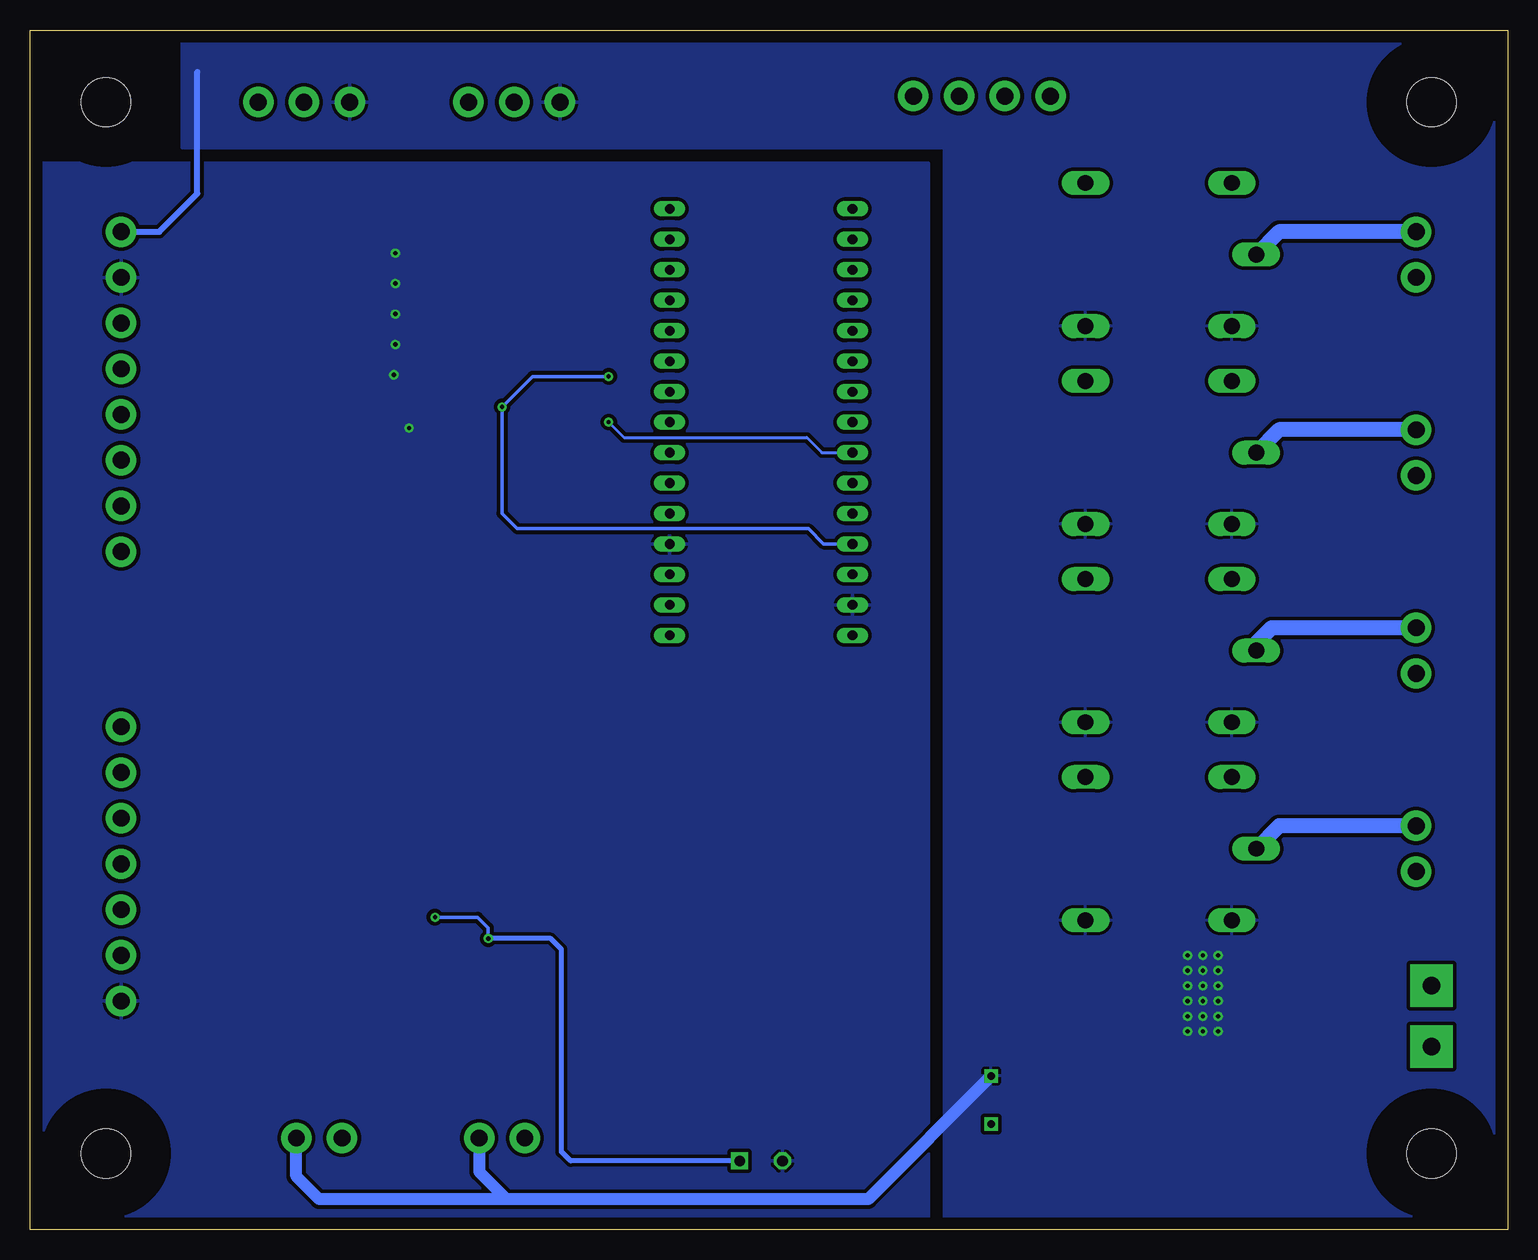
[diagram p6: board, bottom side, seen from below]

Size 123.17 x 100 mm. Coordinates in mm from the lower left corner, seen from the top.
Outline: 0,0 123.17,0 123.17,100 0,100 0,0
Copper layers (1*16): Top 0.035mm / dielectric 0.15mm / Bottom 0.035mm
Design rules "default": minimum track width 6mil, minimum drill 0.35mm, track to track 6mil, track to pad 6mil, pad to pad 6mil, via to via 6mil, smd to smd 6mil, copper to edge 40mil, drill to drill 6mil, minimum pad ring 10mil, minimum via ring 8mil, stop-mask expansion 4mil, vias tented up to drill 0mil, thermal gap 10mil

### Footprints (pad centres in the part's own frame; a part is rotated, then mirrored left to right if it is on the bottom)
691305330002 = drill 1.4 pad 2.54: 1 -1.905,0; 2 1.905,0
C8.15X4X16.5 = drill 0.6 square: + 2.002,0; - -2.002,0
PAN-PTH-8X11X3.5 = drill 0.9 square: + 0,1.778 | drill 0.9 octagon: - 0,-1.778
2EDG-2 = drill 1.473 pad 3.556 square: P$1 0,2.54; P$2 0,-2.54
DO214AC = smd 1.8 x 1.7: A 2.05,0; C -2.05,0
SOD523 = smd 0.7 x 0.5: A 0.7,0; C -0.6,0
4,1 = hole 4.1: 0,0
TO263-5 = smd 1.067 x 2.159: 1 -3.404,-5.791; 2 -1.702,-5.791; 3 0,-5.791; 4 1.702,-5.791; 5 3.404,-5.791 | smd 10.8 x 10.41: 6 0,2.54
SO28W = smd 0.65 x 1.7: 1 -7.62,-4.78; 2 -6.35,-4.78; 3 -5.08,-4.78; 4 -3.81,-4.78; 5 -2.54,-4.78; 6 -1.27,-4.78; 7 0,-4.78; 8 1.27,-4.78; 9 2.54,-4.78; 10 3.81,-4.78; 11 5.08,-4.78; 12 6.35,-4.78; 13 7.62,-4.78; 14 8.89,-4.78; 15 8.89,4.78; 16 7.62,4.78; 17 6.35,4.78; 18 5.08,4.78; 19 3.81,4.78; 20 2.54,4.78; 21 1.27,4.78; 22 0,4.78; 23 -1.27,4.78; 24 -2.54,4.78; 25 -3.81,4.78; 26 -5.08,4.78; 27 -6.35,4.78; 28 -7.62,4.78
691305330008 = drill 1.4 pad 2.54: 1 -13.335,0; 2 -9.525,0; 3 -5.715,0; 4 -1.905,0; 5 1.905,0; 6 5.715,0; 7 9.525,0; 8 13.335,0
691305330003 = drill 1.4 pad 2.54: 1 -3.81,0; 2 0,0; 3 3.81,0
691305330004 = drill 1.4 pad 2.54: 1 -5.715,0; 2 -1.905,0; 3 1.905,0; 4 5.715,0
691305330007 = drill 1.4 pad 2.54: 1 -11.43,0; 2 -7.62,0; 3 -3.81,0; 4 0,0; 5 3.81,0; 6 7.62,0; 7 11.43,0
B82476A1 = smd 3.048 x 2.794: 1 -5.08,0; 2 5.08,0
CHIPLED_0805 = smd 1.2 x 1.2: A 0,-1.05; C 0,1.05
SOIC08-FAIRCHILD = smd 0.61 x 1.52: 1 -1.905,-2.723; 2 -0.635,-2.723; 3 0.635,-2.723; 4 1.905,-2.723; 5 1.905,2.723; 6 0.635,2.723; 7 -0.635,2.723; 8 -1.905,2.723
SOT23-BEC = smd 1 x 1.4: B -0.95,-1.1; C 0,1.1; E 0.95,-1.1
R0805 = smd 1.3 x 1.5: 1 -0.95,0; 2 0.95,0
G5LE = drill 1.321 long: 1 -7.493,-5.969; 2 -7.493,5.969; O 4.699,5.969; P -9.525,0; S 4.699,-5.969
NANO = drill 0.8 long: 3.3V -10.16,24.13; 5V -10.16,-1.27; A0 -10.16,19.05; A1 -10.16,16.51; A2 -10.16,13.97; A3 -10.16,11.43; A4 -10.16,8.89; A5 -10.16,6.35; A6 -10.16,3.81; A7 -10.16,1.27; AREF -10.16,21.59; D2 5.08,1.27; D3 5.08,3.81; D4 5.08,6.35; D5 5.08,8.89; D6 5.08,11.43; D7 5.08,13.97; D8 5.08,16.51; D9 5.08,19.05; D10 5.08,21.59; D11 5.08,24.13; D12 5.08,26.67; D13 -10.16,26.67; GND -10.16,-6.35; GND1 5.08,-1.27; RAW -10.16,-8.89; RST -10.16,-3.81; RST1 5.08,-3.81; RX1 5.08,-6.35; TX0 5.08,-8.89

### Placement (x,y rotation side)
BRAKE  7.62,81.28 270 top
C3  43.05,10.79 90 top
C13  62.23,5.71 270 top
CN1  6.35,17.78 0 top
D1  13.97,15.24 180 top
D2  17.78,64.77 90 top
D3  17.4,81.15 90 top
D4  17.78,48.26 90 top
D5  47.5,4.83 180 top
D6  17.78,31.75 90 top
D7  26.67,3.81 270 top
D9  14.61,81.15 270 top
D10  14.61,64.64 270 top
D11  14.48,48.13 270 top
D12  14.48,31.62 270 top
H1  6.35,6.35 90 top
H2  6.35,93.98 0 top
H3  116.84,93.98 0 top
H4  116.84,6.35 0 top
IC1  53.47,26.67 0 top
IC2  81.28,73.66 270 top
J1  115.57,69.85 90 top
J2  100.33,93.98 180 top
J3  7.62,48.26 270 top
J4  7.62,31.75 270 top
J5  82.8,93.98 180 top
J6  43.81,94.49 180 top
J8  115.57,30.48 90 top
J9  83.82,7.62 0 top
J10  99.06,7.62 0 top
L1  54.61,13.08 0 top
LED1  16.51,3.81 180 top
LED2  20.32,3.81 180 top
LED3  24.13,3.81 180 top
LED4  42.04,28.83 270 top
LED5  41.91,44.32 270 top
LED6  41.91,60.96 270 top
LED7  41.78,77.6 270 top
LOCK  7.62,64.77 270 top
OK1  100.33,72.39 90 top
OK2  100.33,66.04 90 top
OK3  100.33,59.69 90 top
OK4  104.78,84.58 180 top
OK5  88.9,21.59 0 top
Q1  41.91,86.36 0 top
Q2  41.91,69.85 0 top
Q3  41.91,53.34 0 top
Q4  41.91,36.83 0 top
R1  41.91,82.42 180 top
R2  41.91,66.04 180 top
R3  41.91,49.28 180 top
R4  41.91,33.27 180 top
R5  16.51,8.89 90 top
R6  20.32,8.89 90 top
R7  24,8.76 270 top
R8  41.91,80.14 180 top
R9  41.91,63.75 180 top
R10  41.91,46.99 180 top
R11  41.91,31.11 180 top
R12  49.53,67.31 180 top
R13  49.53,64.77 180 top
R14  106.68,71.12 0 top
R15  106.68,73.66 0 top
R16  106.68,64.77 0 top
R17  106.68,67.31 0 top
R18  106.68,58.42 0 top
R19  106.68,60.96 0 top
R20  90.55,68.71 0 top
R21  90.55,76.33 0 top
R22  90.55,71.25 0 top
R23  90.55,73.79 0 top
R24  90.55,81.41 0 top
R25  90.55,78.87 0 top
R26  98.55,80.52 270 top
R27  84.2,84.45 90 top
R28  99.19,88.01 0 top
R29  94.87,88.01 0 top
R30  106.68,22.86 0 top
R31  106.68,26.67 0 top
R32  106.68,30.48 0 top
R33  106.68,34.29 0 top
R34  106.68,38.1 0 top
R35  81.28,16.51 270 top
R36  96.52,16.51 270 top
R37  93.98,21.59 270 top
R38  96.52,21.59 270 top
R39  106.68,41.91 0 top
RL1  30.48,81.28 0 top
RL2  30.48,64.77 0 top
RL3  30.48,48.26 0 top
RL4  30.48,31.75 0 top
U$1  64.77,58.42 0 top

### Tracks (layer width: path | path; a pad name or v marks a point on that pad's centre or on a via)
2^0
  Top 0.254: R30.2 J8.2
2^1
  Top 0.254: R31.2 J8.3
2^2
  Top 0.254: R32.2 J8.4
2^3
  Top 0.254: R33.2 J8.5
+5V  (via drill 0.35)
  Top 0.305: L1.2 53.34,6.73 53.34,2.54 33.02,2.54 30.48,5.08 30.48,11.43 29.21,12.7 21.59,12.7 20.32,11.43 R6.2 | 98.17,57.78 98.11,57.72 96.71,57.72 96.27,58.17 96.27,59.18 93.47,61.98 90.81,61.98 88.9,63.88 88.9,67.18 88.27,67.82 87.76,67.82 87,68.58 IC2.18 v83.82,68.58 | OK4.8 106.68,83.31 106.43,83.57 104.52,83.57 104.14,83.19 OK4.6 104.14,78.49 102.74,77.09 99.82,77.09 99.44,76.71 99.44,73.03 | v84.96,24.26 86.94,24.26 OK5.8 | v89.41,26.04 89.41,24.44 OK5.6 | IC2.9 v74.93,71.12
  Top 0.508: OK1.6 99.44,73.03 99.69,72.77 99.69,70.23 | 99.69,70.23 99.69,66.55 | 99.69,66.55 99.69,64.14 | 99.69,64.14 99.69,60.33 | 99.69,60.33 99.69,58.17 99.31,57.78 98.17,57.78 OK3.8 | OK3.6 99.69,60.33 | OK2.8 99.69,64.14 | OK2.6 99.57,66.67 99.69,66.55 | OK1.8 99.44,70.48 99.69,70.23
  Top 0.813: IC1.4 55.17,17.6 L1.2 60.07,13.08 62.23,15.24 62.23,35.56 59.69,38.1 52.07,38.1 49.53,40.64 49.53,57.15 | U$1.5V 49.53,57.15 | R12.2 R13.2 48.58,58.1 49.53,57.15
  Top 1.27: C13.+ 63.5,6.22 63.5,10.16 60.58,13.08 L1.2
  Bottom 0.305: v89.41,26.04 85.85,26.04 84.96,25.15 v84.96,24.26 | v74.93,71.12 81.28,71.12 v83.82,68.58 83.82,59.69 82.55,58.42 58.29,58.42 57.02,57.15 U$1.5V
  Bottom 0.406: C13.+ 78.11,5.71 78.87,6.48 78.87,23.37 79.76,24.26 v84.96,24.26
BUSY
  Top 0.254: J8.7 R39.2
CMD
  Top 0.254: R34.2 J8.6
DIR
  Top 0.305: J6.3 44.41,91.99 45.09,91.69 66.55,91.69 69.85,88.39 U$1.D12
GND  (via drill 0.35)
  Top 0.254: IC2.17 IC2.16 IC2.15
  Top 0.305: R7.2 23.05,7.81 22.35,7.11 22.35,4.06 21.05,2.76 LED2.C LED1.C
  Top 0.813: C3.- 45.45,6.4 D5.A
  other vias: 92.71,81.41 92.71,78.87 92.71,76.33 92.71,73.79 92.84,71.25 91.57,66.8
  pour Top (isolate 0.406, rank 4): 0,0 160.02,0 160.02,99.06 160.02,100.33 0,100.33
  pour Bottom (isolate 0.305): 48.26,88.9 123.19,88.9 123.19,0 48.26,0
GPA0
  Top 0.305: IC2.21 87.12,72.39 87.38,72.14 87.38,69.09 87.76,68.71 R20.1 89.6,64.2 91.06,62.74 93.7,62.74 96.72,59.72 96.95,59.72 OK3.7
GPA1
  Top 0.305: IC2.22 87.19,73.66 88.01,72.84 88.01,71.5 88.27,71.25 R22.1 90.83,70.02 92.24,70.02 93.6,68.66 93.6,63.63 93.98,63.25 94.61,63.25 96.27,61.59 OK3.5
GPA2
  Top 0.305: IC2.23 87.5,74.93 87.88,74.55 87.88,74.04 88.14,73.79 R23.1 90.17,73.22 90.17,72.77 90.42,72.52 93.09,72.52 93.73,71.88 93.73,69.47 94.36,68.83 94.36,65.79 94.74,65.41 OK2.7
GPA3
  Top 0.305: IC2.24 89.47,76.2 R21.1 89.6,75.37 89.92,75.06 93.6,75.06 94.49,74.17 94.49,69.6 95,69.09 95,68.33 95.25,68.07 97.48,68.07 OK2.5
GPA4
  Top 0.305: IC2.25 88.01,77.47 88.27,77.72 88.27,78.74 88.39,78.87 R25.1 89.6,78.55 90.51,77.64 93.81,77.64 95.38,76.07 95.38,72.01 95.63,71.75 OK1.7
GPA5
  Top 0.305: IC2.26 87.12,78.74 88.39,80.01 88.39,81.03 88.77,81.41 R24.1 89.6,80.71 90.17,80.14 93.6,80.14 96.14,77.6 96.14,74.8 96.65,74.3 OK1.5
GPA6
  Top 0.305: OK4.7 105.41,80.64 105.92,80.14 107.44,80.14 108.2,80.9 108.2,83.82 107.44,84.58 87.94,84.58 86.87,83.5 R27.1 84.2,80.14 84.33,80.01 IC2.27
GPA7
  Top 0.305: OK4.5 101.66,81.86 | 101.66,81.86 100.2,83.31 88.01,83.31 87.5,82.8 87.5,81.53 87.25,81.28 IC2.28 | R26.1 101.27,81.47 101.66,81.86
GPB0
  Top 0.254: IC2.1 80.01,81.28 81.79,79.5 81.79,30.35 81.92,30.23 102.11,30.23 102.87,30.99 102.87,36.45 104.39,37.97 104.39,41.53 104.78,41.91 R39.1
GPB1
  Top 0.254: R34.1 103.38,35.75 103.38,30.86 102.23,29.72 81.53,29.72 81.28,29.97 81.28,78.49 79.88,79.88 76.63,79.88 IC2.2
GPB2
  Top 0.254: R33.1 104.46,34.29 103.89,33.72 103.89,30.73 102.36,29.21 81.28,29.21 80.77,29.72 80.77,77.34 79.38,78.74 IC2.3
GPB3
  Top 0.254: IC2.4 78.87,77.47 80.26,76.07 80.26,29.46 81,28.73 104.14,28.73 105.73,30.32 R32.1
GPB4
  Top 0.254: IC2.5 78.61,76.2 79.76,75.06 79.76,29.21 80.77,28.19 104.21,28.19 R31.1
GPB5
  Top 0.254: IC2.6 78.23,74.93 79.25,73.91 79.25,28.96 80.49,27.71 89.7,27.71 92.52,24.89 103.89,24.89 105.73,23.05 R30.1
GPB6
  Top 0.254: IC2.7 77.69,73.66 78.74,72.61 78.74,28.7 80.26,27.18 89.53,27.18 90.81,25.91 OK5.5 96.52,24.31 R38.1
GPB7
  Top 0.254: IC2.8 76.63,72.26 77.47,72.26 78.23,71.5 78.23,28.45 80.01,26.67 87.63,26.67 88.27,26.04 OK5.7 88.27,22.99 88.77,22.48 93.92,22.48 R37.1
N$1
  Top 0.305: J1.1 113.67,58.42 R18.2
N$2
  Top 0.305: R28.1 98.24,88.71 100.33,90.81 J2.2
N$3
  Top 0.813: J4.1 14.46,33.66 D12.C
  Bottom 1.27: J4.1 19.05,33.66 RL4.P
N$4
  Top 0.813: J3.1 14.46,50.16 D11.C
  Bottom 1.27: J3.1 19.68,50.16 20.95,48.9 RL3.P
N$5
  Top 0.305: OK4.1 106.68,88.14 106.05,88.77 100.9,88.77 R28.2
N$6
  Top 0.305: R29.2 95.82,86.43 96.52,85.72 103.76,85.72 104.14,86.11 OK4.3
N$7
  Top 0.305: J5.2 82.8,89.92 84.71,88.01 R29.1
N$9
  Top 0.813: LOCK.1 14.59,66.67 D10.C
  Bottom 1.27: LOCK.1 19.05,66.67 RL2.P
N$11
  Top 0.813: BRAKE.1 14.59,83.19 D9.C
  Bottom 1.27: BRAKE.1 19.05,83.19 RL1.P
N$12
  Top 0.305: J1.3 114.94,64.77 R16.2
N$13
  Top 0.406: D2.A 17.78,69.85 19.05,71.12 22.61,71.12 RL2.2 24.51,72.26 37.18,72.26 38.5,70.95 Q2.C
N$14
  Top 0.406: R11.2 40.96,28.86 LED4.A
N$15
  Top 0.406: D4.A 17.78,53.34 19.05,54.61 22.61,54.61 RL3.2 24.71,55.96 36.73,55.96 38.24,54.44 Q3.C
N$16
  Top 0.305: R7.1 24.45,10.16 25.4,10.16 26.67,8.89 26.67,7.62 24.13,5.08 LED3.A 26.22,4.86 D7.C
N$17
  Top 0.406: RL1.2 22.86,87.25 | 22.86,87.25 18.67,87.25 17.4,85.98 D3.A | Q1.C 38.12,87.46 36.6,88.98 24.59,88.98 22.86,87.25
N$18
  Top 0.406: D6.A 17.78,36.83 18.67,37.72 22.86,37.72 | 22.86,37.72 RL4.2 | Q4.C 38.37,37.93 36.85,39.45 24.59,39.45 22.86,37.72
N$19
  Top 0.813: D5.C 49.55,13.06 | 49.55,13.06 L1.1 | IC1.2 51.77,15.28 49.55,13.06
N$20
  Top 0.305: Q1.B R1.2
N$21
  Top 0.305: Q2.B R2.2
N$22
  Top 0.305: Q3.B R3.2
N$23
  Top 0.305: Q4.B R4.2
N$24
  Top 0.305: D7.A 26.32,2.76 LED3.C 22.64,1.27 15.24,1.27 13.97,2.54 13.97,13.19 D1.A
  Top 1.27: D1.A CN1.P$2
N$25
  Top 0.254: LED1.A R5.1
N$26
  Top 0.254: LED2.A R6.1
N$27
  Top 0.406: R10.2 40.86,46.89 LED5.A
N$28
  Top 0.406: LED6.A 40.86,63.65 R9.2
N$29
  Top 0.406: R8.2 40.73,79.91 LED7.A
N$30
  Top 0.305: J1.4 108.27,67.94 R17.2
N$31
  Top 0.305: R15.2 109.53,75.56 J1.6
N$34
  Top 0.305: J1.5 108.27,71.75 R14.2
N$35
  Top 0.305: OK2.3 105.09,66.67 R17.1
N$36
  Top 0.305: OK1.1 105.09,70.48 R14.1
N$37
  Top 0.305: OK1.3 105.09,73.03 R15.1
N$38
  Top 0.305: OK2.1 105.09,64.14 R16.1
N$40
  Top 0.305: OK3.1 105.09,57.78 R18.1
N$41
  Top 0.305: OK3.3 105.09,60.33 R19.1
N$42
  Top 0.305: J1.2 114.94,60.96 R19.2
N$45
  Top 0.254: R35.2 81.28,8.26 J9.1
N$46
  Top 0.254: R36.2 96.52,8.26 J10.1
N$49
  Top 0.254: OK5.3 89.53,17.65 89.73,17.46 R36.1
N$50
  Top 0.254: OK5.1 81.86,18.87 81.28,18.29 R35.1
RL1
  Top 0.305: U$1.A0 46.99,77.47 44.32,80.14 R8.1 R1.1
RL2
  Top 0.305: U$1.A1 46.99,74.93 44.45,72.39 44.45,67.31 43.18,66.04 R2.1 R9.1
RL3
  Top 0.305: U$1.A2 46.99,72.39 45.59,70.99 45.59,52.01 R3.1 R10.1
RL4
  Top 0.305: U$1.A3 48.01,69.85 46.74,68.58 46.74,48.39 44.58,46.23 44.58,34.67 43.18,33.27 R4.1 R11.1
SCL  (via drill 0.35)
  Top 0.254: IC2.12 v74.93,67.31
  Top 0.813: U$1.A5 R13.1
  Bottom 0.254: v74.93,67.31 73.66,66.04 58.42,66.04 57.15,64.77 U$1.A5
SDA
  Top 0.254: IC2.13 58.42,66.04
  Top 0.305: 58.42,66.04 57.15,67.31 U$1.A4
  Top 0.813: R12.1 U$1.A4
STEP
  Top 0.305: J6.1 64.64,94.49 71.88,87.25 71.88,83.31 71.12,82.55 U$1.D11
VCC  (via drill 0.35)
  Top 0.254: RL4.1 19.3,25.78 17.78,27.3 D6.C | D4.C 17.78,43.18 18.67,42.29 RL3.1
  Top 0.305: R5.2 16.51,14.75 D1.C
  Top 0.406: D3.C 17.4,77.34 19.43,75.31 RL1.1 | RL2.1 18.54,58.8 17.78,59.56 D2.C
  Top 1.27: D1.C 22.86,15.24 | IC1.1 43.18,20.88 43.05,20.75 43.05,15.24 | RL4.1 22.99,15.37 22.86,15.24 | C3.+ 43.05,15.24 | 22.86,15.24 43.05,15.24
  Bottom 0.508: J1.8 112.39,83.19 109.22,86.36 109.22,96.52
  Bottom 1.016: C3.+ 53.31,2.54 83.44,2.54 | 83.44,2.54 99.06,2.54 100.97,4.45 J10.2 | J9.2 85.72,4.83 83.44,2.54
  other vias: 24.13,22.86 25.4,22.86 26.67,22.86 24.13,21.59 25.4,21.59 26.67,21.59 26.67,20.32 25.4,20.32 24.13,20.32 24.13,19.05 25.4,19.05 26.67,19.05 24.13,17.78 25.4,17.78 26.67,17.78 26.67,16.51 25.4,16.51 24.13,16.51
  pour Bottom (isolate 0.305): 0,100.33 46.99,100.33 46.99,0 0,0
  pour Top (isolate 0.254, rank 2): 22.86,24.13 27.94,24.13 27.94,15.24 22.86,15.24
  pour Bottom (isolate 0.305, rank 3): 38.1,90.17 110.49,90.17 110.49,100.33 38.1,100.33

### Text on the board
tPlace: DIR-/+ | STEP-/+ | LOCK | INDEX | ANGULAR POSITION ENCODER | depronman | depronman | Turret Controller | Version 1.1 | LinuxCNC | 12-24VDC | GND | GR : VCC okay / BL : +5V okay / RD : VCC Inverted | JOG+ | JOG-